# Altium project HA.PrjPcb
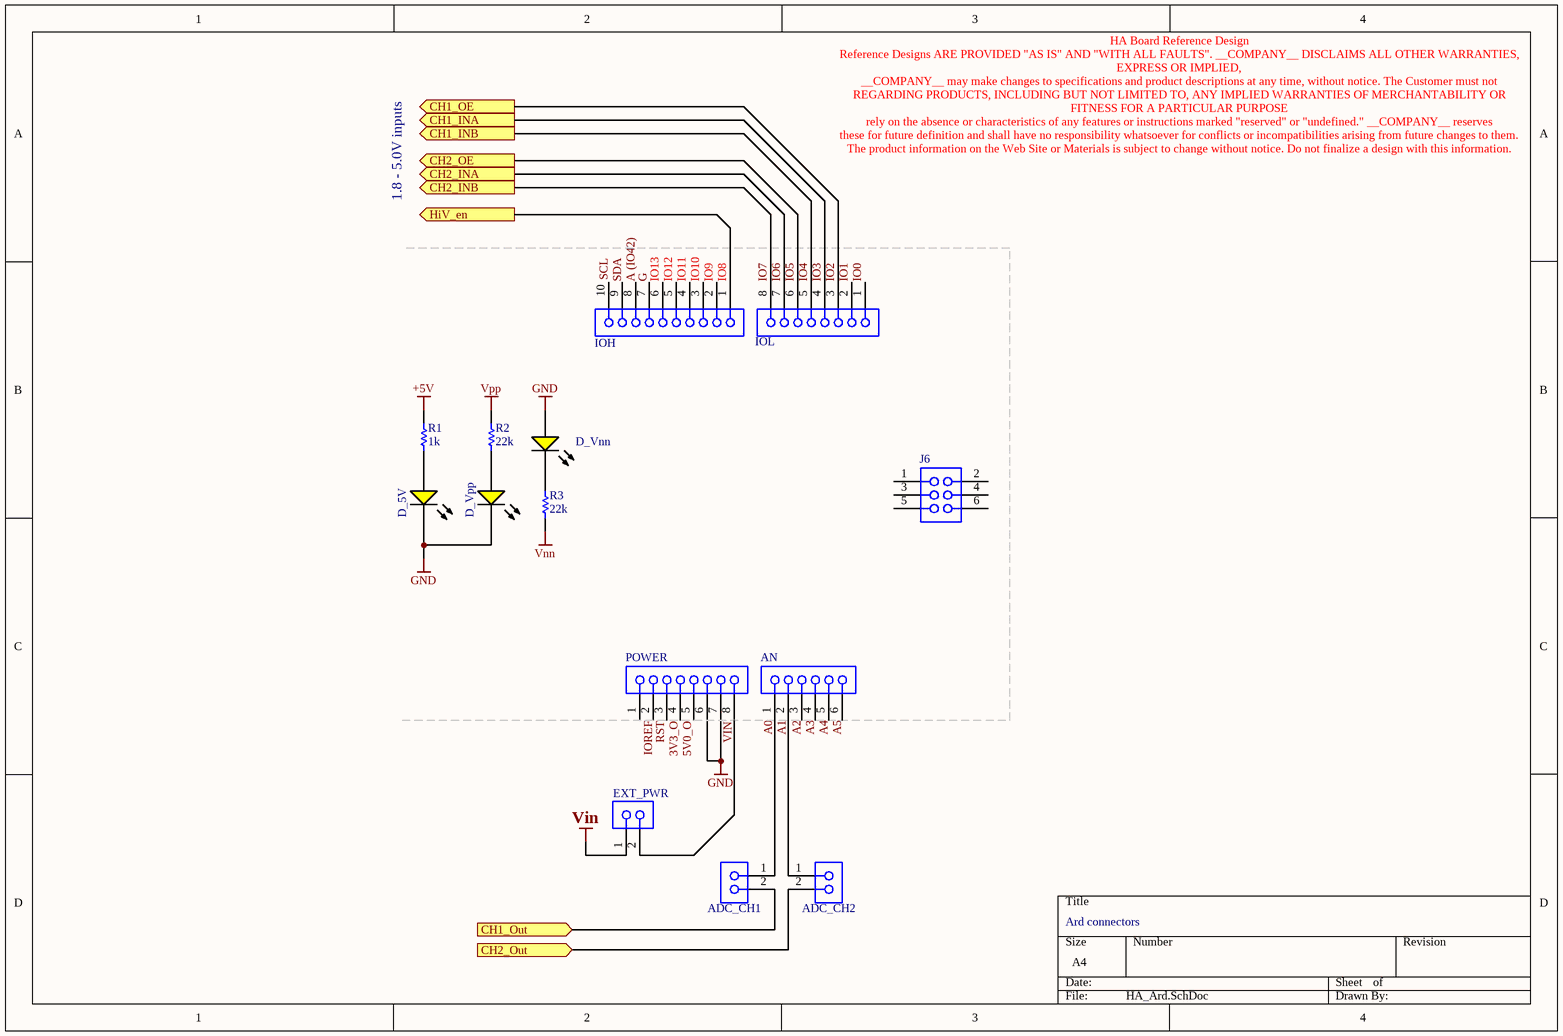
[diagram p0: HA_Ard.SchDoc]
ProjectName: AAE; Title: AAE
3 sheets, 80 parts. Net scope: flat (ports and power ports of the same name join across sheets).
Sheets:
  HA_Ard.SchDoc
  HA_Power.SchDoc
  HA_Out.SchDoc

## Sheet HA_Ard.SchDoc: Ard connectors
size A4; PageSetup: Record=PageOptions|CenterHorizontal=True|CenterVertical=True|PrintScale=1.02|XCorrection=1.00|YCorrection=1.00|PrintKind=0|BorderSize=5000000|LeftOffset=0|BottomOffset=0|Orientation=2|PaperLength=1000|PaperWidth=1000|Scale=100|PaperSource=257|PrintQuality=-3|MediaType=1|DitherType=10|PrintScaleMode=1|PaperKind=A4 (Borderless)|PaperIndex=123

### Parts
ADC_CH1  PHF-102-03-L-S  [SMTC-PHF-102-03-X-S]  (value not drawn)
ADC_CH2  PHF-102-03-L-S  [SMTC-PHF-102-03-X-S]  (value not drawn)
AN  SSW-106-02-G-S  [SMTC-SSW-106-02-X-S]  (value not drawn)
D_5V  LED 0603 Green  [LTST-C190KSKT_V]  (value not drawn)
D_Vnn  LED 0603 Green  [LTST-C190KSKT_V]  (value not drawn)
D_Vpp  LED 0603 Green  [LTST-C190KSKT_V]  (value not drawn)
EXT_PWR  PHF-102-03-L-S  [SMTC-PHF-102-03-X-S]  (value not drawn)
IOH  SSW-110-03-G-S  [SMTC-SSW-110-03-X-S]  (value not drawn)
IOL  SSQ-108-01-F-S  [SMTC-SSQ-108-01-X-S]  (value not drawn)
J6  SSW-103-01-F-D  [SMTC-SSW-103-01-X-D]  (value not drawn)
POWER  SSQ-108-01-F-S  [SMTC-SSQ-108-01-X-S]  (value not drawn)
R1  1k  [RESC0603(1608)_N]
R2  22k  [RESC0603(1608)_N]
R3  22k  [RESC0603(1608)_N]

### Ports
CH1_INA (out), CH1_INB (out), CH1_OE (out), CH1_Out (in), CH2_INA (out), CH2_INB (out), CH2_OE (out), CH2_Out (in), HiV_en (out)

### Nets
+5V: R1.1
GND: D_5V.2(K) D_Vnn.1(A) D_Vpp.2(K) POWER.6 POWER.7
Vin: EXT_PWR.1
Vnn: R3.1
Vpp: R2.1
CH1_Out: ADC_CH1.2 ; port CH1_Out
CH2_Out: ADC_CH2.2 ; port CH2_Out
HiV_en: IOH.1 ; port HiV_en
IO0: IOL.1
IO1: IOL.2
IO2: IOL.3 ; port CH1_OE
IO3: IOL.4 ; port CH1_INA
IO4: IOL.5 ; port CH1_INB
IO5: IOL.6 ; port CH2_OE
IO6: IOL.7 ; port CH2_INA
IO7: IOL.8 ; port CH2_INB
NetADC_CH1_1: ADC_CH1.1 AN.1
NetADC_CH2_1: ADC_CH2.1 AN.2
NetD_5V_1: D_5V.1(A) R1.2
NetD_Vnn_2: D_Vnn.2(K) R3.2
NetD_Vpp_1: D_Vpp.1(A) R2.2
NetEXT_PWR_2: EXT_PWR.2 POWER.8

Not connected (* = marked no-connect by the designer): AN 3 4 5 6; IOH 2 3 4 5 6 7 8 9 10; J6 1 2 3 4 5 6; POWER 1 2 3 4 5

### Notes on the sheet
- 1.8 - 5.0V inputs
- HA Board Reference Design
  Reference Designs ARE PROVIDED "AS IS" AND "WITH ALL FAULTS". __COMPANY__ DISCLAIMS ALL OTHER WARRANTIES, EXPRESS OR IMPLIED,
  __COMPANY__ may make changes to specifications and product descriptions at any time, without notice. The Customer must not
  REGARDING PRODUCTS, INCLUDING BUT NOT LIMITED TO, ANY IMPLIED WARRANTIES OF MERCHANTABILITY OR FITNESS FOR A PARTICULAR PURPOSE
  rely on the absence or characteristics of any features or instructions marked "reserved" or "undefined." __COMPANY__ reserves
  these for future definition and shall have no responsibility whatsoever for conflicts or incompatibilities arising from future changes to them.
  The product information on the Web Site or Materials is subject to change without notice. Do not finalize a design with this information.
- (near IOH) IO13
- (near IOH) IO12
- (near IOH) IO11
- (near IOH) IO10
- (near IOH) IO9
- (near IOH) IO8
- Labels drawn without touching a wire or pin: 3V3_O, 5V0_O, A0, A1, A2, A3, A4, A5, A (IO42), G, IOREF, RST, SCL, SDA, VIN
- Title
- Size:
- Date:
- A4
- Number:
- Time:
- Revision:
- Sheet
- of
- File:

### Library data of the parts
ADC_CH1 ADC_CH2 EXT_PWR = CMP-1023-00105-1: Press Fit Socket, Through-hole, Vertical, -55 to 125 degC, 2.54 mm Pitch, 2-Pin, Female, RoHS; Manufacturer: Samtec; Pitch: 2.54 mm; Orientation: Vertical; RoHS: True; DatasheetVersion: F-214; PackageReference: PHF-102-03-X-S; Temperature Range: -55 to 125 degC; ComponentLink1Description: Manufacturer URL; ComponentLink3Description: Package Specification; PackageVersion: F, 9/2009; ComponentLink2Description: Datasheet; ComponentLink3URL: http://www.samtec.com/documents/webfiles/cpdf/PHF-1XX-XX-X-X-XXX-MKT.pdf; PartNumber: PHF-102-03-L-S; ComponentLink1URL: http://www.samtec.com; ComponentLink2URL: http://www.samtec.com/documents/webfiles/pdf/phf.pdf; Mounting Technology: Through-hole; PackageDescription: .100 Press Fit Socket Assembly
AN = CMP-1023-00359-1: SQ Post Socket, Through-hole, Vertical, -55 to 125 degC, 2.54mm Pitch, 6-Pin, Female, RoHS; Manufacturer: Samtec; ComponentLink1Description: Manufacturer URL; Pitch: 2.54 mm; ComponentLink1URL: http://www.samtec.com; ComponentLink2Description: Datasheet; PackageVersion: CA, 6/1987; Orientation: Vertical; RoHS: True; PackageReference: SSW-106-02-X-S; ComponentLink2URL: http://www.samtec.com/documents/webfiles/pdf/SSW_TH.PDF; Mounting Technology: Through-hole; Temperature Range: -55 to 125 degC; PackageDescription: Assembly, Socket Strip .016 X .031 Tail; DatasheetVersion: F-214; ComponentLink3Description: Package Specification; PartNumber: SSW-106-02-G-S; ComponentLink3URL: http://www.samtec.com/documents/webfiles/cpdf/SSW-1XX-XX-XXX-X-XX-XXX-XX-MKT.pdf
D_5V D_Vnn = CMP-1674-00009-1: Manufacturer: Vishay; MPN: TLMG1100-GS08; Value: LED 0603 Green
D_Vpp = CMP-1674-00009-1: MPN: TLMG1100-GS08; Manucturer: Vishay; Value: LED 0603 Green
IOH = CMP-1023-00394-1: SQ Post Socket, Through-hole, Vertical, -55 to 125 degC, 2.54 mm Pitch, 10-Pin, Female, RoHS; Manufacturer: Samtec; Pitch: 2.54 mm; PartNumber: SSW-110-03-G-S; ComponentLink2Description: Datasheet; ComponentLink3URL: http://www.samtec.com/documents/webfiles/cpdf/SSW-1XX-XX-XXX-X-XX-XXX-XX-MKT.pdf; ComponentLink1URL: http://www.samtec.com; RoHS: True; ComponentLink1Description: Manufacturer URL; ComponentLink2URL: http://www.samtec.com/documents/webfiles/pdf/SSW_TH.PDF; Temperature Range: -55 to 125 degC; PackageDescription: Assembly, Socket Strip .016 X .031 Tail; ComponentLink3Description: Package Specification; PackageReference: SSW-110-03-X-S; Orientation: Vertical; DatasheetVersion: F-214; PackageVersion: CA, 6/1987; Mounting Technology: Through-hole
IOL POWER = CMP-1023-00294-1: SQ Post Socket, Through-hole, Vertical, -55 to 125 degC, 2.54 mm Pitch, 8-Pin, Female, RoHS; Manufacturer: Samtec; Pitch: 2.54 mm; ComponentLink3URL: http://www.samtec.com/documents/webfiles/cpdf/SSQ-1XX-XX-XXX-X-XX-XXX-XX-X-MKT.pdf; ComponentLink2URL: http://www.samtec.com/documents/webfiles/pdf/SSQ_TH.PDF; Mounting Technology: Through-hole; PackageReference: SSQ-108-01-X-S; Orientation: Vertical; PackageDescription: Assembly, Socket Strip .025[0.64] SQ Tail; ComponentLink2Description: Datasheet; PartNumber: SSQ-108-01-F-S; Temperature Range: -55 to 125 degC; ComponentLink1URL: http://www.samtec.com; ComponentLink3Description: Package Specification; PackageVersion: BD, 6/1987; RoHS: True; ComponentLink1Description: Manufacturer URL; DatasheetVersion: F-214
J6 = CMP-1023-00329-1: SQ Post Socket, Through-hole, Vertical, -55 to 125 degC, 2.54 mm Pitch, 6-Pin, Female, RoHS; Manufacturer: Samtec; Pitch: 2.54 mm; Temperature Range: -55 to 125 degC; ComponentLink3URL: http://www.samtec.com/documents/webfiles/cpdf/SSW-1XX-XX-XXX-X-XX-XXX-XX-MKT.pdf; ComponentLink1URL: http://www.samtec.com; Orientation: Vertical; PackageReference: SSW-103-01-X-D; RoHS: True; ComponentLink1Description: Manufacturer URL; PartNumber: SSW-103-01-F-D; PackageVersion: CA, 6/1987; ComponentLink2URL: http://www.samtec.com/documents/webfiles/pdf/SSW_TH.PDF; ComponentLink3Description: Package Specification; Mounting Technology: Through-hole; PackageDescription: Assembly, Socket Strip .016 X .031 Tail; DatasheetVersion: F-214; ComponentLink2Description: Datasheet
R1 = CMP-1012-00122-1: Tolerance: 1 %; Value: 1k
R2 R3 = CMP-1012-00122-1: 1% 0603 SMD; Value: 22k; Tolerance: 1 %

## Sheet HA_Power.SchDoc: Power supply
size A4; Date: 11/21/2016 9:12:52 PM; SheetNumber: 2; PageSetup: Record=PageOptions|CenterHorizontal=True|CenterVertical=True|PrintScale=1.02|XCorrection=1.00|YCorrection=1.00|PrintKind=0|BorderSize=5000000|LeftOffset=0|BottomOffset=0|Orientation=2|PaperLength=1000|PaperWidth=1000|Scale=100|PaperSource=257|PrintQuality=600|MediaType=1|DitherType=10|PrintScaleMode=1|PaperKind=A4 (Borderless)|PaperIndex=123
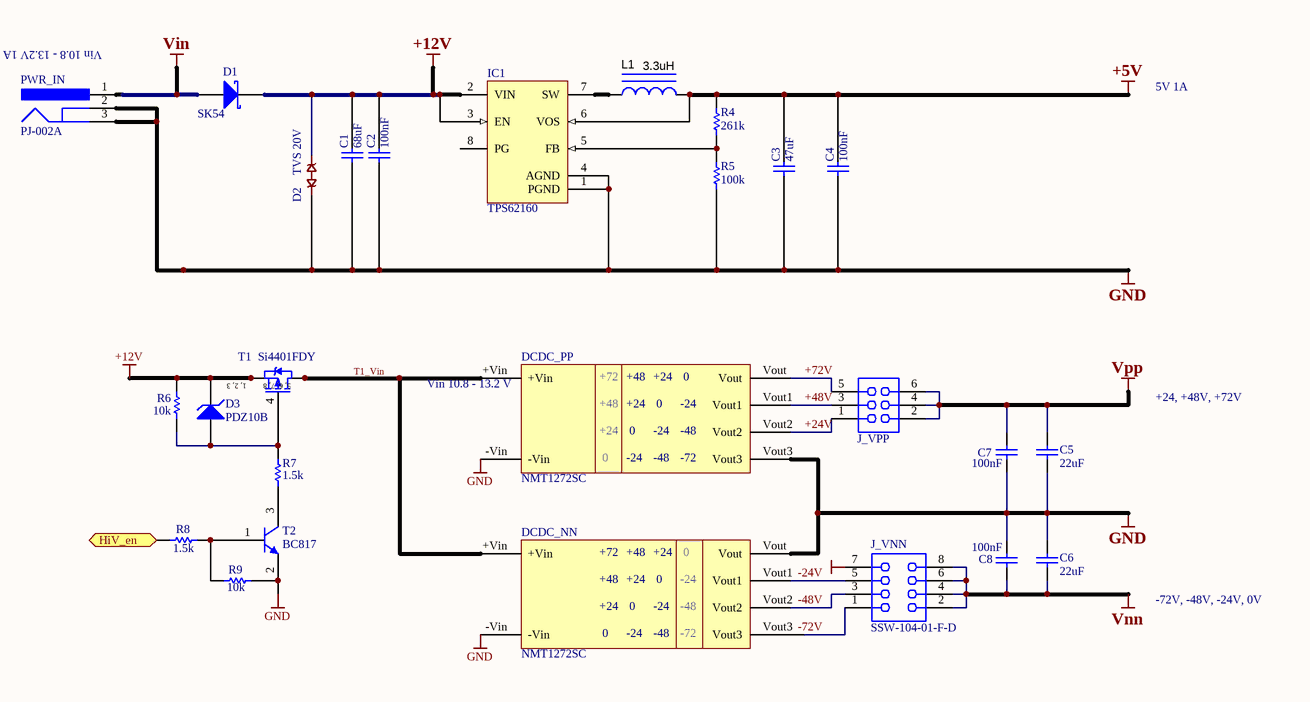
[diagram p1: HA_Power.SchDoc]

### Parts
C1  68uF  [MURA-GRM-55D_V]
C2  100nF  [CAPC0805(2012)75_N]
C3  47uF  [CAPC0805(2012)75_N]
C4  100nF  [CAPC0805(2012)75_N]
C5  22uF  [MURA-GRM-55D_V]
C6  22uF  [MURA-GRM-55D_V]
C7  100nF  [CAPC0805(2012)75_N]
C8  100nF  [CAPC0805(2012)75_N]
D1  SK54  [VISH-DO-214AC-2_V]
D2  TVS 20V  [DO214AC_BIDIR]
D3  PDZ10B  [NXP-SOD323_V]
DCDC_NN  NMT1272SC  [NMT1272SC]
DCDC_PP  NMT1272SC  [NMT1272SC]
IC1  TPS62160  [DGK8_N]
J_VNN  SSW-104-01-F-D  [SMTC-SSW-104-01-X-D]
J_VPP  SSW-103-01-F-D  [SMTC-SSW-103-01-X-D]  (value not drawn)
L1  3.3uH  [XPL2010]
PWR_IN  PJ-002A  [CUI-PJ-002A_V]
R4  261k  [RESC0805(2012)_L]
R5  100k  [RESC0805(2012)_L]
R6  10k  [RESC0805(2012)_L]
R7  1.5k  [RESC0805(2012)_L]
R8  1.5k  [RESC0805(2012)_L]
R9  10k  [RESC0805(2012)_L]
T1  Si4401FDY  [SO08]
T2  BC817  [DIOD-SOT323-3_V]

### Ports
HiV_en (in)

### Nets
+5V: C3.2 C4.2 IC1.6(VOS) L1.2 R4.1
+12V: C1.2 C2.2 D1.2(K) D2.2 D3.2(K) IC1.2(VIN) IC1.3(EN) R6.1 T1.1(S) T1.2(S) T1.3(S)
GND: C1.1 C2.1 C3.1 C4.1 C5.1 C6.2 C7.1 C8.2 D2.1 DCDC_NN.-Vin DCDC_NN.Vout DCDC_PP.-Vin DCDC_PP.Vout3 IC1.1(PGND) IC1.4(AGND) J_VNN.7 PWR_IN.2 PWR_IN.3 R5.2 R9.1 T2.2(E)
Vin: D1.1(A) PWR_IN.1
Vnn: C6.1 C8.1 J_VNN.2 J_VNN.4 J_VNN.6 J_VNN.8
Vpp: C5.2 C7.2 J_VPP.2 J_VPP.4 J_VPP.6
+24V: DCDC_PP.Vout2 J_VPP.1  [project net +24V_2]
+48V: DCDC_PP.Vout1 J_VPP.3  [project net +48V_2]
+72V: DCDC_PP.Vout J_VPP.5  [project net +72V_2]
-24V: DCDC_NN.Vout1 J_VNN.5  [project net -24V_2]
-48V: DCDC_NN.Vout2 J_VNN.3  [project net -48V_2]
-72V: DCDC_NN.Vout3 J_VNN.1  [project net -72V_2]
HiV_en: R8.2 ; port HiV_en
T1_Vin: DCDC_NN.+Vin DCDC_PP.+Vin T1.5(D) T1.6(D) T1.7(D) T1.8(D)  [project net T1_Vin_2]
NetD3_1: D3.1(A) R6.2 R7.2 T1.4(G)
NetIC1_5: IC1.5(FB) R4.2 R5.1
NetIC1_7: IC1.7(SW) L1.1
NetR7_1: R7.1 T2.3(C)
NetR8_1: R8.1 R9.2 T2.1(B)

Not connected (* = marked no-connect by the designer): IC1 8(PG)

### Notes on the sheet
- (near PWR_IN) Vin 10.8 - 13.2V 1A
- 5V 1A
- (near DCDC_PP) Vin 10.8 - 13.2 V
- +24, +48V, +72V
- -72V, -48V, -24V, 0V
- Title
- Size:
- Date:
- A4
- Number:
- Time:
- Revision:
- Sheet
- of
- File:
- (in symbol NMT1272SC) +72; +48; +24; 0; -24; -48; -72
- (in symbol P-MOSFET2) 1, 2, 3; 5, 6, 7, 8

### Library data of the parts
C1 = CMP-0817-00001-1: MPN: KRM55WR71E686MH01L; Manufacturer: Murata; Height Dimension: 2.0 mm; Value: 68uF
C2 = CMP-1036-00417-1: Case-EIA: 0805; Tolerance: ±10%; Case-Metric: 2012; Rated Voltage: 50 V; Technology: SMT; Max Thickness: 0.75 mm; Value: 100nF
C3 = CMP-1036-00417-1: PartNumber: GRM21BR61A476ME15L; Case-EIA: 0805; Tolerance: ±10%; Case-Metric: 2012; Rated Voltage: 10 V; Technology: SMT; Max Thickness: 0.75 mm; Value: 47uF
C4 = CMP-1036-00417-1: Case-EIA: 0805; Tolerance: ±10%; Case-Metric: 2012; Rated Voltage: 10 V; Technology: SMT; Max Thickness: 0.75 mm; Value: 100nF
C5 C6 = CMP-0817-00001-1: MPN: KRM55WR72A226MH01L; Manufacturer: Murata; Rated Voltage: 100 V; Value: 22uF
C7 C8 = CMP-1036-00417-1: Case-EIA: 0805; Tolerance: ±10%; Case-Metric: 2012; Value: 100nF 100V; Rated Voltage: 100 V; Technology: SMT; Max Thickness: 0.75 mm
D1 = CMP-0549-00004-1: Schottky Barrier Rectifier, 40 V Maximum DC Blocking Voltage, -65 to 125 degC, 2-Pin SMA Case, RoHS; Manufacturer: Micro commercial co; MPN: SK54A-LTP; Package: SMA DO-214AC; Value: SK54
D2 = DIODE_BIDIR-DO214AC: Manufacturer: Bourns; Value: SMAJ20CA; MPN: SMAJ20CA
D3 = CMP-2000-06888-1: Zener diode; Manufacturer: NXP; Value: PDZ10B; MPN: PDZ10B
DCDC_NN DCDC_PP = NMT1272SC: pin to pad: +Vin>1 -Vin>2 Vout>5 Vout1>6 Vout2>7 Vout3>8; Manufacturer: Murata; MPN: NMT1272SC; Value: NMT1272SC
IC1 = CMP-0323-00440-1: Buck Step Down Regulator with 3 to 17 V Input and 0.9 to 6 V Output, -40 to 85 degC, 8-Pin VSOP (DGK), Green (RoHS & no Sb/Br); Manufacturer: Texas Instruments; MPN: TPS62160DGKR; PackageReference: DGK8; Value: TPS62160
J_VNN = CMP-1023-00336-1: SQ Post Socket, Through-hole, Vertical, -55 to 125 degC, 2.54mm Pitch, 8-Pin, Female, RoHS; Manufacturer: Samtec; ComponentLink2Description: Datasheet; ComponentLink1Description: Manufacturer URL; ComponentLink2URL: http://www.samtec.com/documents/webfiles/pdf/SSW_TH.PDF; ComponentLink1URL: http://www.samtec.com; Pitch: 2.54 mm; ComponentLink3Description: Package Specification; PackageReference: SSW-104-01-X-D; RoHS: True; PackageVersion: CA, 6/1987; DatasheetVersion: F-214; ComponentLink3URL: http://www.samtec.com/documents/webfiles/cpdf/SSW-1XX-XX-XXX-X-XX-XXX-XX-MKT.pdf; Mounting Technology: Through-hole; Temperature Range: -55 to 125 degC; Orientation: Vertical; PartNumber: SSW-104-01-F-D; PackageDescription: Assembly, Socket Strip .016 X .031 Tail
J_VPP = CMP-1023-00329-1: as J6 on sheet HA_Ard; Temperature Range: -55 to 125 degC; ComponentLink3URL: http://www.samtec.com/documents/webfiles/cpdf/SSW-1XX-XX-XXX-X-XX-XXX-XX-MKT.pdf; ComponentLink1URL: http://www.samtec.com; Orientation: Vertical; PackageReference: SSW-103-01-X-D; RoHS: True; ComponentLink1Description: Manufacturer URL; PartNumber: SSW-103-01-F-D; PackageVersion: CA, 6/1987; ComponentLink2URL: http://www.samtec.com/documents/webfiles/pdf/SSW_TH.PDF; ComponentLink3Description: Package Specification; Mounting Technology: Through-hole; PackageDescription: Assembly, Socket Strip .016 X .031 Tail; DatasheetVersion: F-214; ComponentLink2Description: Datasheet
L1 = XPL2010-332MLB: XPL2010 Inductor; Manufacturer: Coilcraft; Value: 3.3uH; MPN: XPL2010-332MLB; PackageReference: XPL2010
PWR_IN = CMP-2000-06895-1: Through Hole Right Angle DC Power Jack, 2.5 A, 2 mm Center Pin, 3 Position, -25 to 85 degC, RoHS, Bulk; Manufacturer: CUIInc.; Current Rating: 2.5A; Inside Contact Diameter: 2mm; Insulation Resistance: 50MOhms; Outside Contact Diameter: 6.5mm; Voltage Rating: 24V; Brand: CUI; Operating Temperature Range: -25Cto+85C; Mounting Technology: ThroughHole; Connector Type: DCPowerJack; Contact Material: Copper; Datasheet URL: http://www.cui.com/product/resource/pj-002a.pdf; Contact Gender: Male; Housing Material: PolybutyleneTerephthalate(PBT); Manufacturer URL: http://www.cui.com/; Package Reference: PJ-002A; Mounting Style: ThroughHole; Mounting Angle: Right; Product Category: DCPowerConnectors; Product: Jacks; Flammability Rating: UL94V-0; Contact Plating: Nickel; RoHS: True; Datasheet Version: Rev. 1.03, 04/2016; Package Description: 3-Pin Through Hole Device, Body 14.4 x 9 mm, Height 11 mm; Factory Pack Quantity: 500; Termination Style: ThroughHole
R4-R9 = CMP-1013-00429-1: 0.125W 1% 0805 (2012 Metric)  SMD; Case-EIA: 0805; Case-Metric: 2012; Technology: SMT; Power: 0.125 W; Tolerance: 1 %
  R4: Value: 261k
  R5: Value: 100k
  R6 R9: Value: 10k
  R7 R8: Value: 1.5k
T1 = P-MOSFET2: HEXFET Power MOSFET; Value: Si4401FDY; MPN: Si4401FDY
T2 = CMP-2000-05934-1: NPN Small Signal Transistor, 45 V, 500 mA; Manufacturer: DiodesIncorporated; MPN: BC817-40W-7; Package / Case: SOT-23; Transistor Polarity: NPN; Package Reference: SOT323; Value: BC817

## Sheet HA_Out.SchDoc: Piezo driver
size A4; Date: 03 oct 2018; Author: TO; Revision: ver B; SheetNumber: 1; PageSetup: Record=PageOptions|CenterHorizontal=True|CenterVertical=True|PrintScale=1.02|XCorrection=1.00|YCorrection=1.00|PrintKind=0|BorderSize=5000000|LeftOffset=0|BottomOffset=0|Orientation=2|PaperLength=1000|PaperWidth=1000|Scale=100|PaperSource=257|PrintQuality=600|MediaType=1|DitherType=10|PrintScaleMode=1|PaperKind=A4 (Borderless)|PaperIndex=123
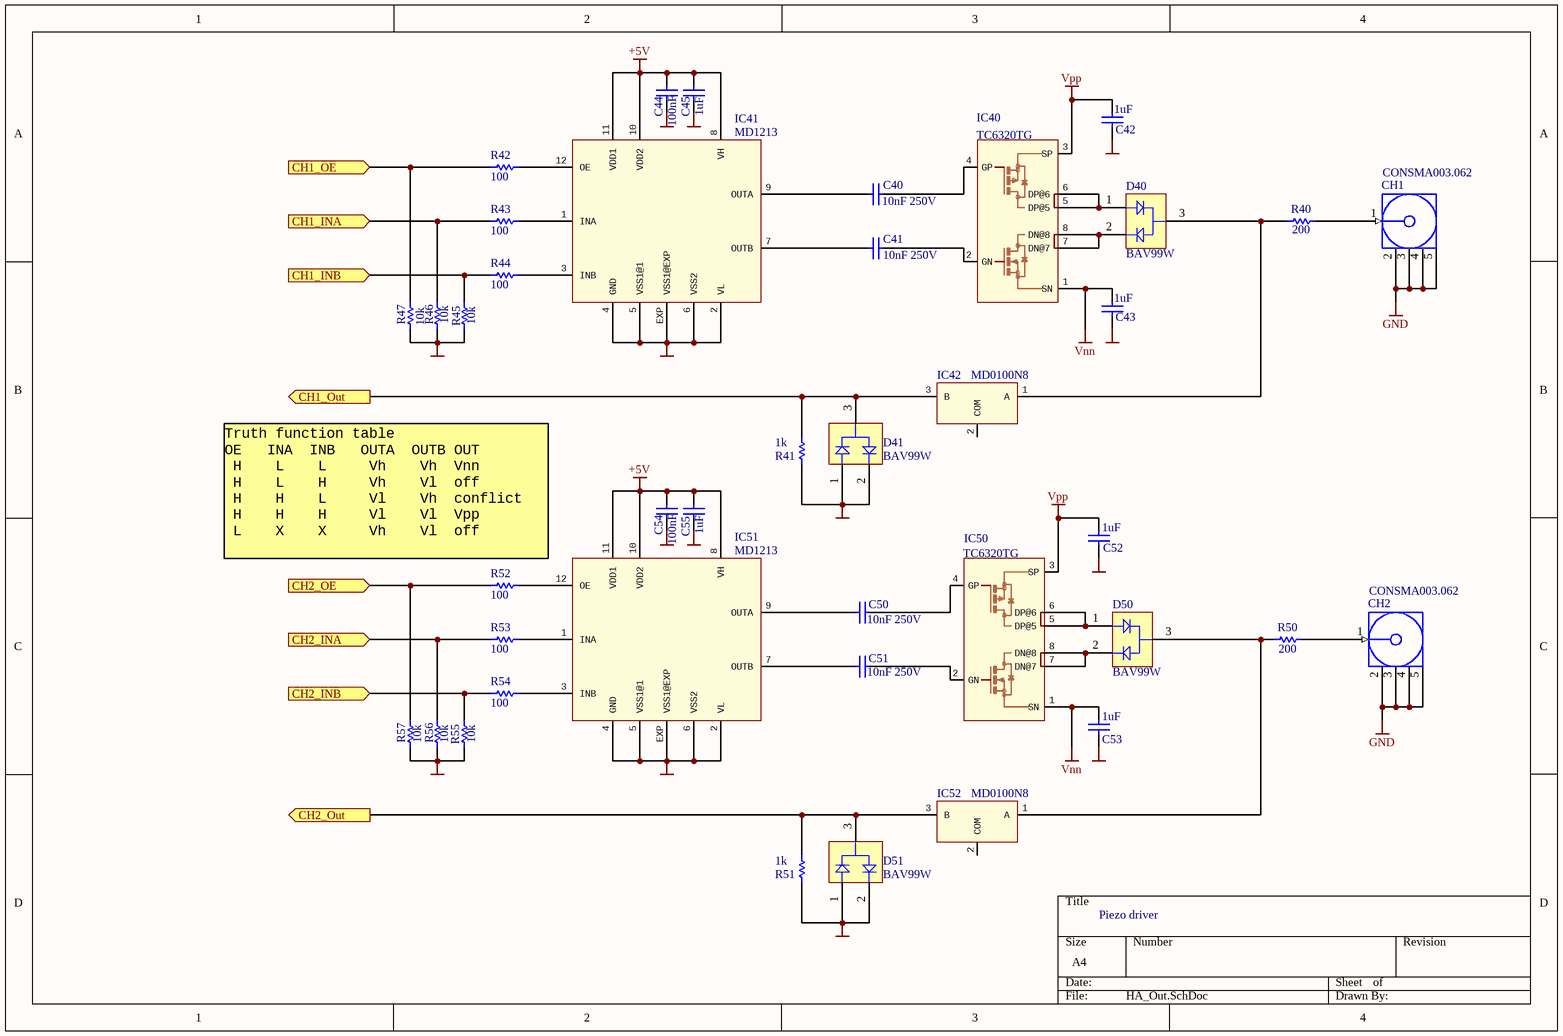
[diagram p2: HA_Out.SchDoc]

### Parts
C40  10nF 250V  [CAPC0805(2012)75_N]
C41  10nF 250V  [CAPC0805(2012)75_N]
C42  1uF  [CAPC1206(3216)190_N]
C43  1uF  [CAPC1206(3216)190_N]
C44  100nF  [CAPC0805(2012)75_N]
C45  1uF  [CAPC0805(2012)75_N]
C50  10nF 250V  [CAPC0805(2012)75_N]
C51  10nF 250V  [CAPC0805(2012)75_N]
C52  1uF  [CAPC1206(3216)190_N]
C53  1uF  [CAPC1206(3216)190_N]
C54  100nF  [CAPC0805(2012)75_N]
C55  1uF  [CAPC0805(2012)75_N]
CH1  CONSMA003.062  [CON-SMA-EDGE062]
CH2  CONSMA003.062  [CON-SMA-EDGE062]
D40  BAV99W  [INF-SOT323_M]
D41  BAV99W  [INF-SOT323_M]
D50  BAV99W  [INF-SOT323_M]
D51  BAV99W  [INF-SOT323_M]
IC40  TC6320TG  [SO08]
IC41  MD1213  [AMS-QFN-12-4000X4000DE-2125X2125TP_L]
IC42  MD0100N8  [SOT89]
IC50  TC6320TG  [SO08]
IC51  MD1213  [AMS-QFN-12-4000X4000DE-2125X2125TP_L]
IC52  MD0100N8  [SOT89]
R40  200  [RESC0805(2012)_L]
R41  1k  [RESC0805(2012)_L]
R42  100  [RESC0805(2012)_L]
R43  100  [RESC0805(2012)_L]
R44  100  [RESC0805(2012)_L]
R45  10k  [RESC0805(2012)_L]
R46  10k  [RESC0805(2012)_L]
R47  10k  [RESC0805(2012)_L]
R50  200  [RESC0805(2012)_L]
R51  1k  [RESC0805(2012)_L]
R52  100  [RESC0805(2012)_L]
R53  100  [RESC0805(2012)_L]
R54  100  [RESC0805(2012)_L]
R55  10k  [RESC0805(2012)_L]
R56  10k  [RESC0805(2012)_L]
R57  10k  [RESC0805(2012)_L]

### Ports
CH1_INA (in), CH1_INB (in), CH1_OE (in), CH1_Out (out), CH2_INA (in), CH2_INB (in), CH2_OE (in), CH2_Out (out)

### Nets
+5V: C44.2 C45.2 C54.2 C55.2 IC41.8(VH) IC41.10(VDD2) IC41.11(VDD1) IC51.8(VH) IC51.10(VDD2) IC51.11(VDD1)
GND: C42.1 C43.1 C44.1 C45.1 C52.1 C53.1 C54.1 C55.1 CH1.2(GND) CH1.3(GND) CH1.4(GND) CH1.5(GND) CH2.2(GND) CH2.3(GND) CH2.4(GND) CH2.5(GND) D41.1(A1) D41.2(K2) D51.1(A1) D51.2(K2) IC41.2(VL) IC41.4(GND) IC41.5(VSS1@1) IC41.6(VSS2) IC41.EXP(VSS1@EXP) IC51.2(VL) IC51.4(GND) IC51.5(VSS1@1) IC51.6(VSS2) IC51.EXP(VSS1@EXP) R41.2 R45.2 R46.2 R47.2 R51.2 R55.2 R56.2 R57.2
Vnn: C43.2 C53.2 IC40.1(SN) IC50.1(SN)
Vpp: C42.2 C52.2 IC40.3(SP) IC50.3(SP)
CH1_Out: D41.3(C) IC42.3(B) R41.1 ; port CH1_Out
CH2_Out: D51.3(C) IC52.3(B) R51.1 ; port CH2_Out
IO2: R42.1 R47.1 ; port CH1_OE
IO3: R43.1 R46.1 ; port CH1_INA
IO4: R44.1 R45.1 ; port CH1_INB
IO5: R52.1 R57.1 ; port CH2_OE
IO6: R53.1 R56.1 ; port CH2_INA
IO7: R54.1 R55.1 ; port CH2_INB
NetC40_1: C40.1 IC40.4(GP)
NetC40_2: C40.2 IC41.9(OUTA)
NetC41_1: C41.1 IC40.2(GN)
NetC41_2: C41.2 IC41.7(OUTB)
NetC50_1: C50.1 IC50.4(GP)
NetC50_2: C50.2 IC51.9(OUTA)
NetC51_1: C51.1 IC50.2(GN)
NetC51_2: C51.2 IC51.7(OUTB)
NetCH1_1: CH1.1(Signal) R40.2
NetCH2_1: CH2.1(Signal) R50.2
NetD40_1: D40.1(A1) IC40.5(DP@5) IC40.6(DP@6)
NetD40_2: D40.2(K2) IC40.7(DN@7) IC40.8(DN@8)
NetD40_3: D40.3(C) IC42.1(A) R40.1
NetD50_1: D50.1(A1) IC50.5(DP@5) IC50.6(DP@6)
NetD50_2: D50.2(K2) IC50.7(DN@7) IC50.8(DN@8)
NetD50_3: D50.3(C) IC52.1(A) R50.1
NetIC41_1: IC41.1(INA) R43.2
NetIC41_3: IC41.3(INB) R44.2
NetIC41_12: IC41.12(OE) R42.2
NetIC51_1: IC51.1(INA) R53.2
NetIC51_3: IC51.3(INB) R54.2
NetIC51_12: IC51.12(OE) R52.2

Not connected (* = marked no-connect by the designer): IC42 2(COM); IC52 2(COM)

### Notes on the sheet
- Truth function table
  OE   INA  INB   OUTA  OUTB OUT
  H    L    L     Vh    Vh  Vnn
  H    L    H     Vh    Vl  off
  H    H    L     Vl    Vh  conflict
  H    H    H     Vl    Vl  Vpp
  L    X    X     Vh    Vl  off
- Title
- Size:
- Date:
- A4
- Number:
- Time:
- Revision:
- Sheet
- of
- File:

### Library data of the parts
C40 C41 C50 C51 = CMP-1036-00417-1: CAP 0805 (2012 Metric) Thickness 0.75mm SMD; Case-EIA: 0805; Tolerance: ±10%; Case-Metric: 2012; Technology: SMT; Max Thickness: 0.75 mm; Value: 10nF; Rated Voltage: 250 V
C42 C43 C52 C53 = CMP-1037-04411-1: CAP 1206 (3216 Metric) Thickness 1.9mm SMD; Case-Metric: 3216; Tolerance: Â±20%; Rated Voltage: 100 V; Case-EIA: 1206; Max Thickness: 1.9 mm; Technology: SMT; Value: 1uF
C44 C45 C54 C55 = CMP-1036-00417-1: as C4 on sheet HA_Power; Technology: SMT; Max Thickness: 0.75 mm
  C44 C54: Value: 100nF
  C45 C55: Value: 1uF
CH1 CH2 = CMP-0168-00029-1: SMA Female Edge Mount Connector for 0.062" Thick Board; PCB_Layout: Pads complies with manufacturer's recommendation.; PackageReference: CON-SMA-EDGE062; PackageDescription: SMA Female Edge Mount Connector for 0.062" Thick Board, 7.9 mm Body Dia.; PackageVersion: rev1.0, Aug-2006; DatasheetVersion: rev1.0, Aug-2006
D40 D41 D50 D51 = CMP-1176-00026-1: Silicon Switching Diode, SOT323, Reel, Green; Manufacturer: Diodes Inc; MPN: BAV99W-7-F; PackageReference: SOT323; Value: BAV99W
IC40 IC50 = TC6320: Manufacturer: Microchip; MPN: TC6320TG-G; Value: TC6320TG
IC41 IC51 = MD1213: Manufacturer: Microchip; MPN: MD1213K6-G; Value: MD1213
IC42 = MD0100N8: MPN: MD0100N8-G; Manufacturer: Microchip; Value: MD0100N8
IC52 = MD0100N8: Manufacturer: Microchip; MPN: MD0100N8-G; Value: MD0100N8
R40-R47 R50-R57 = CMP-1013-00429-1: as R4 on sheet HA_Power; Technology: SMT; Power: 0.125 W; Tolerance: 1 %
  R40 R50: Value: 200
  R41 R51: Value: 1k
  R42-R44 R52-R54: Value: 100
  R45-R47 R55-R57: Value: 10k

## Nets that join several sheets
+5V: HA_Ard (R1.1), HA_Power (5 pins), HA_Out (10 pins)
GND: HA_Ard (5 pins), HA_Power (21 pins), HA_Out (38 pins)
Vin: HA_Ard (EXT_PWR.1), HA_Power (D1.1 PWR_IN.1)
Vnn: HA_Ard (R3.1), HA_Power (6 pins), HA_Out (C43.2 C53.2 IC40.1 IC50.1)
Vpp: HA_Ard (R2.1), HA_Power (5 pins), HA_Out (C42.2 C52.2 IC40.3 IC50.3)
CH1_Out: HA_Ard (ADC_CH1.2), HA_Out (D41.3 IC42.3 R41.1)
CH2_Out: HA_Ard (ADC_CH2.2), HA_Out (D51.3 IC52.3 R51.1)
HiV_en: HA_Ard (IOH.1), HA_Power (R8.2)
IO2: HA_Ard (IOL.3), HA_Out (R42.1 R47.1)
IO3: HA_Ard (IOL.4), HA_Out (R43.1 R46.1)
IO4: HA_Ard (IOL.5), HA_Out (R44.1 R45.1)
IO5: HA_Ard (IOL.6), HA_Out (R52.1 R57.1)
IO6: HA_Ard (IOL.7), HA_Out (R53.1 R56.1)
IO7: HA_Ard (IOL.8), HA_Out (R54.1 R55.1)